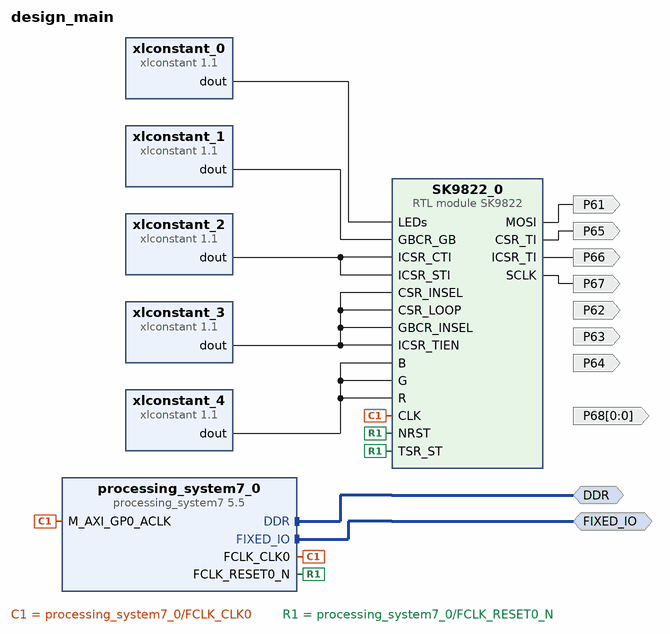
[diagram p0: block diagram of the top level]
# Vivado block design design_main, xc7z020clg400-1, Vivado 2023.2
create_bd_design design_main

create_bd_intf_port -mode Master -vlnv xilinx.com:interface:ddrx_rtl:1.0 DDR
create_bd_intf_port -mode Master -vlnv xilinx.com:display_processing_system7:fixedio_rtl:1.0 FIXED_IO
create_bd_port -dir O P61
create_bd_port -dir O P62
create_bd_port -dir O P63
create_bd_port -dir O P64
create_bd_port -dir O P65
create_bd_port -dir O P66
create_bd_port -dir O -from 0 -to 0 P68
create_bd_port -dir O P67

create_bd_cell -type ip -vlnv xilinx.com:ip:processing_system7:5.5 processing_system7_0
set_property -dict [list \
  CONFIG.PCW_APU_PERIPHERAL_FREQMHZ 666.666666 \
  CONFIG.PCW_ENET0_PERIPHERAL_ENABLE 0 \
  CONFIG.PCW_EN_CLK1_PORT 1 \
  CONFIG.PCW_FPGA0_PERIPHERAL_FREQMHZ 5 \
  CONFIG.PCW_FPGA1_PERIPHERAL_FREQMHZ 0.5 \
  CONFIG.PCW_FPGA_FCLK1_ENABLE 1 \
  CONFIG.PCW_GPIO_MIO_GPIO_ENABLE 0 \
  CONFIG.PCW_PERIPHERAL_BOARD_PRESET None \
  CONFIG.PCW_PRESET_BANK1_VOLTAGE {LVCMOS 1.8V} \
  CONFIG.PCW_QSPI_PERIPHERAL_ENABLE 0 \
  CONFIG.PCW_SD0_GRP_CD_ENABLE 1 \
  CONFIG.PCW_SD0_GRP_CD_IO {MIO 46} \
  CONFIG.PCW_SD0_GRP_WP_ENABLE 1 \
  CONFIG.PCW_SD0_GRP_WP_IO {MIO 47} \
  CONFIG.PCW_SD0_PERIPHERAL_ENABLE 1 \
  CONFIG.PCW_SD0_SD0_IO {MIO 40 .. 45} \
  CONFIG.PCW_SDIO_PERIPHERAL_FREQMHZ 50 \
  CONFIG.PCW_UART1_PERIPHERAL_ENABLE 1 \
  CONFIG.PCW_UART1_UART1_IO {MIO 48 .. 49} \
  CONFIG.PCW_UART_PERIPHERAL_FREQMHZ 100 \
  CONFIG.PCW_UIPARAM_DDR_FREQ_MHZ 533.333333 \
  CONFIG.PCW_UIPARAM_DDR_PARTNO {MT41J256M16 RE-125} \
  CONFIG.PCW_USB0_PERIPHERAL_ENABLE 0 \
  CONFIG.preset None \
] [get_bd_cells processing_system7_0]
# 366 more settings of processing_system7_0 are not shown: defaults, MIO pin electricals, DDR timing, and values the tool derives
create_bd_cell -type ip -vlnv xilinx.com:ip:xlconstant:1.1 xlconstant_0
set_property -dict {CONFIG.CONST_VAL 0x030507010F0F0FFF CONFIG.CONST_WIDTH 64} [get_bd_cells xlconstant_0]
create_bd_cell -type ip -vlnv xilinx.com:ip:xlconstant:1.1 xlconstant_4
set_property -dict {CONFIG.CONST_VAL 5 CONFIG.CONST_WIDTH 8} [get_bd_cells xlconstant_4]
create_bd_cell -type ip -vlnv xilinx.com:ip:xlconstant:1.1 xlconstant_1
set_property -dict {CONFIG.CONST_VAL 7 CONFIG.CONST_WIDTH 5} [get_bd_cells xlconstant_1]
create_bd_cell -type ip -vlnv xilinx.com:ip:xlconstant:1.1 xlconstant_3
create_bd_cell -type ip -vlnv xilinx.com:ip:xlconstant:1.1 xlconstant_2
set_property -dict {CONFIG.CONST_VAL 0} [get_bd_cells xlconstant_2]
create_bd_cell -type module -reference SK9822 SK9822_0
set_property -dict {CONFIG.LED_number 2} [get_bd_cells SK9822_0]

# ---- connections ----

connect_bd_intf_net [get_bd_intf_ports DDR] [get_bd_intf_pins processing_system7_0/DDR]
connect_bd_intf_net [get_bd_intf_ports FIXED_IO] [get_bd_intf_pins processing_system7_0/FIXED_IO]
connect_bd_net [get_bd_pins SK9822_0/CSR_TI] [get_bd_ports P65]
connect_bd_net [get_bd_pins SK9822_0/ICSR_TI] [get_bd_ports P66]
connect_bd_net [get_bd_pins SK9822_0/MOSI] [get_bd_ports P61]
connect_bd_net [get_bd_pins SK9822_0/SCLK] [get_bd_ports P67]
connect_bd_net [get_bd_pins processing_system7_0/FCLK_CLK0] [get_bd_pins processing_system7_0/M_AXI_GP0_ACLK] [get_bd_pins SK9822_0/CLK]
connect_bd_net [get_bd_pins processing_system7_0/FCLK_RESET0_N] [get_bd_pins SK9822_0/NRST] [get_bd_pins SK9822_0/TSR_ST]
connect_bd_net [get_bd_pins xlconstant_0/dout] [get_bd_pins SK9822_0/LEDs]
connect_bd_net [get_bd_pins xlconstant_1/dout] [get_bd_pins SK9822_0/GBCR_GB]
connect_bd_net [get_bd_pins xlconstant_2/dout] [get_bd_pins SK9822_0/ICSR_CTI] [get_bd_pins SK9822_0/ICSR_STI]
connect_bd_net [get_bd_pins xlconstant_3/dout] \
  [get_bd_pins SK9822_0/CSR_INSEL] [get_bd_pins SK9822_0/CSR_LOOP] [get_bd_pins SK9822_0/GBCR_INSEL] \
  [get_bd_pins SK9822_0/ICSR_TIEN]
connect_bd_net [get_bd_pins xlconstant_4/dout] [get_bd_pins SK9822_0/R] [get_bd_pins SK9822_0/G] [get_bd_pins SK9822_0/B]

validate_bd_design
save_bd_design
